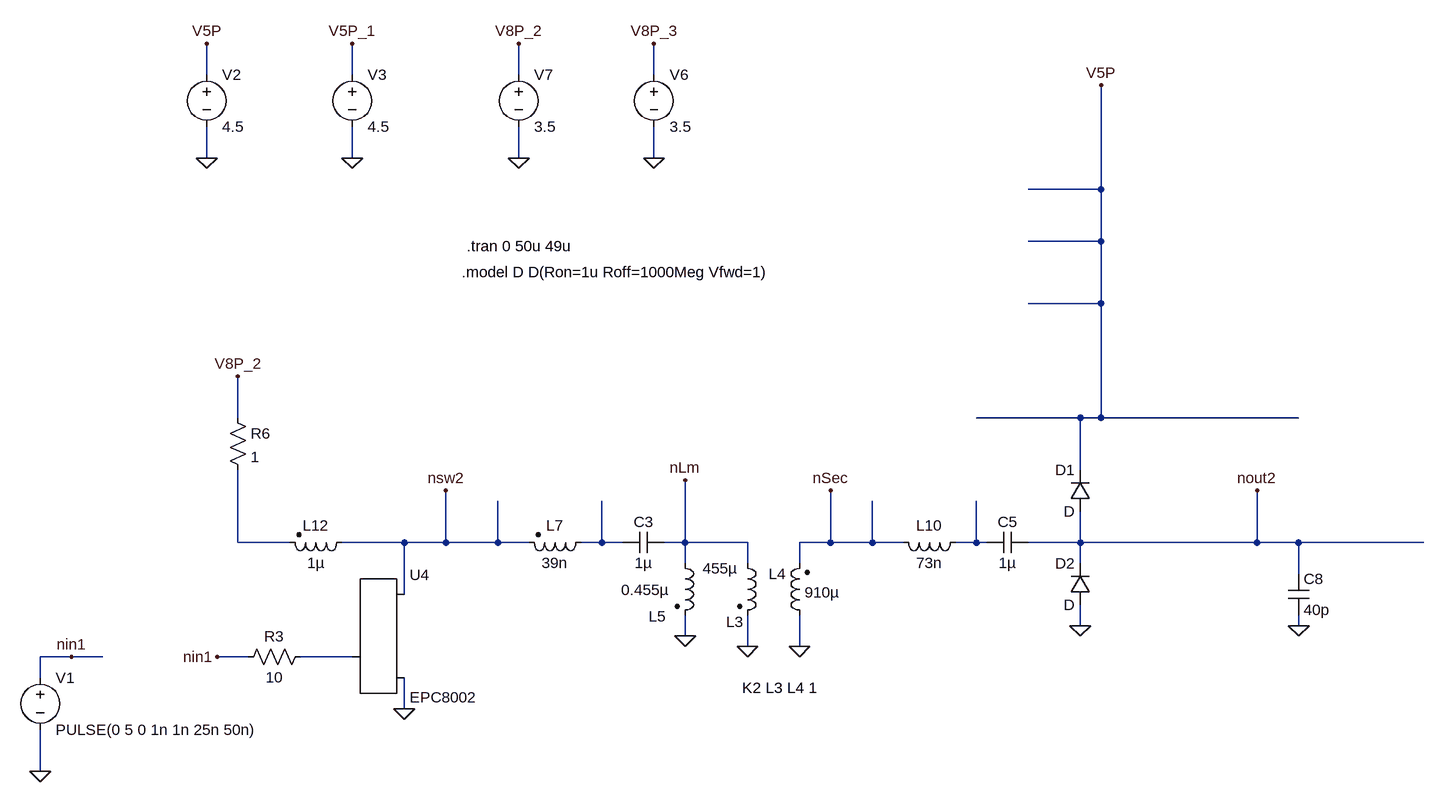
[diagram p0: schematic Ultrafast GD - 02162024.asc]
Ultrafast GD - 02162024.asc, the LTspice schematic file:
Version 4
SHEET 1 2564 2228
WIRE -528 0 -528 -48
WIRE -304 0 -304 -48
WIRE -48 0 -48 -48
WIRE 160 0 160 -48
WIRE -528 128 -528 80
WIRE -304 128 -304 80
WIRE -48 128 -48 80
WIRE 160 128 160 80
WIRE 848 176 848 16
WIRE 848 176 736 176
WIRE 848 256 848 176
WIRE 848 256 736 256
WIRE 848 352 848 256
WIRE 848 352 736 352
WIRE -480 528 -480 464
WIRE 816 528 656 528
WIRE 848 528 848 352
WIRE 848 528 816 528
WIRE 1152 528 848 528
WIRE 816 608 816 528
WIRE -480 720 -480 608
WIRE -400 720 -480 720
WIRE -224 720 -320 720
WIRE -160 720 -160 640
WIRE -160 720 -224 720
WIRE -80 720 -80 656
WIRE -80 720 -160 720
WIRE -32 720 -80 720
WIRE 80 720 80 656
WIRE 80 720 48 720
WIRE 112 720 80 720
WIRE 208 720 208 624
WIRE 208 720 176 720
WIRE 304 720 208 720
WIRE 432 720 432 640
WIRE 432 720 384 720
WIRE 496 720 496 656
WIRE 496 720 432 720
WIRE 544 720 496 720
WIRE 656 720 656 656
WIRE 656 720 624 720
WIRE 672 720 656 720
WIRE 816 720 816 672
WIRE 816 720 736 720
WIRE 1088 720 1088 640
WIRE 1088 720 816 720
WIRE 1152 720 1088 720
WIRE 1344 720 1152 720
WIRE 208 752 208 720
WIRE 304 752 304 720
WIRE 384 752 384 720
WIRE 816 752 816 720
WIRE 1152 768 1152 720
WIRE -224 800 -224 720
WIRE 816 848 816 816
WIRE 1152 848 1152 832
WIRE 208 864 208 832
WIRE 304 880 304 832
WIRE 384 880 384 832
WIRE -736 896 -784 896
WIRE -688 896 -736 896
WIRE -464 896 -512 896
WIRE -304 896 -384 896
WIRE -784 928 -784 896
WIRE -224 976 -224 928
WIRE -784 1072 -784 1008
FLAG -528 128 0
FLAG -528 -48 V5P
FLAG -784 1072 0
FLAG -736 896 nin1
FLAG 304 880 0
FLAG 384 880 0
FLAG 816 848 0
FLAG -224 976 0
FLAG -480 464 V8P_2
FLAG 1088 640 nout2
FLAG -160 640 nsw2
FLAG -48 128 0
FLAG -48 -48 V8P_2
FLAG -512 896 nin1
FLAG 1152 848 0
FLAG 848 16 V5P
FLAG 208 864 0
FLAG 208 624 nLm
FLAG 432 640 nSec
FLAG 160 128 0
FLAG 160 -48 V8P_3
FLAG -304 128 0
FLAG -304 -48 V5P_1
SYMBOL voltage -784 912 R0
WINDOW 123 0 0 Left 0
WINDOW 39 0 0 Left 0
SYMATTR InstName V1
SYMATTR Value PULSE(0 5 0 1n 1n 25n 50n)
SYMBOL voltage -528 -16 R0
WINDOW 123 0 0 Left 0
WINDOW 39 0 0 Left 0
SYMATTR InstName V2
SYMATTR Value 4.5
SYMBOL ind2 288 736 R0
WINDOW 0 -17 106 Left 2
WINDOW 3 -53 24 Left 2
SYMATTR InstName L3
SYMATTR Value 455µ
SYMATTR Type ind
SYMBOL ind2 400 848 R180
WINDOW 0 36 80 Left 2
WINDOW 3 -46 51 Left 2
SYMATTR InstName L4
SYMATTR Value 910µ
SYMATTR Type ind
SYMBOL cap 176 704 R90
WINDOW 0 0 32 VBottom 2
WINDOW 3 32 32 VTop 2
SYMATTR InstName C3
SYMATTR Value 1µ
SYMBOL cap 736 704 R90
WINDOW 0 0 32 VBottom 2
WINDOW 3 32 32 VTop 2
SYMATTR InstName C5
SYMATTR Value 1µ
SYMBOL EPCGaN -304 896 R0
SYMATTR InstName U4
SYMATTR Value EPC8002
SYMBOL res -368 880 R90
WINDOW 0 0 56 VBottom 2
WINDOW 3 32 56 VTop 2
SYMATTR InstName R3
SYMATTR Value 10
SYMBOL ind2 64 704 R90
WINDOW 0 5 56 VBottom 2
WINDOW 3 32 56 VTop 2
SYMATTR InstName L7
SYMATTR Value 39n
SYMATTR SpiceLine Rser=0.85
SYMATTR Type ind
SYMBOL ind 640 704 R90
WINDOW 0 5 56 VBottom 2
WINDOW 3 32 56 VTop 2
SYMATTR InstName L10
SYMATTR Value 73n
SYMATTR SpiceLine Rser=1.7
SYMBOL ind2 -304 704 R90
WINDOW 0 5 56 VBottom 2
WINDOW 3 32 56 VTop 2
SYMATTR InstName L12
SYMATTR Value 1µ
SYMATTR Type ind
SYMBOL voltage -48 -16 R0
WINDOW 123 0 0 Left 0
WINDOW 39 0 0 Left 0
SYMATTR InstName V7
SYMATTR Value 3.5
SYMBOL res -496 512 R0
SYMATTR InstName R6
SYMATTR Value 1
SYMBOL diode 832 672 R180
WINDOW 0 24 64 Left 2
WINDOW 3 24 0 Left 2
SYMATTR InstName D1
SYMBOL diode 832 816 R180
WINDOW 0 24 64 Left 2
WINDOW 3 24 0 Left 2
SYMATTR InstName D2
SYMBOL cap 1136 768 R0
SYMATTR InstName C8
SYMATTR Value 40p
SYMBOL ind2 192 736 R0
WINDOW 0 -40 98 Left 2
WINDOW 3 -82 57 Left 2
SYMATTR InstName L5
SYMATTR Value 0.455µ
SYMATTR Type ind
SYMBOL voltage 160 -16 R0
WINDOW 123 0 0 Left 0
WINDOW 39 0 0 Left 0
SYMATTR InstName V6
SYMATTR Value 3.5
SYMBOL voltage -304 -16 R0
WINDOW 123 0 0 Left 0
WINDOW 39 0 0 Left 0
SYMATTR InstName V3
SYMATTR Value 4.5
TEXT -128 264 Left 2 !.tran 0 50u 49u
TEXT -136 304 Left 2 !.model D D(Ron=1u Roff=1000Meg Vfwd=1)
TEXT 296 944 Left 2 !K2 L3 L4 1

The netlist it stands for:
* Ultrafast GD - 02162024.asc
V1 nin1 0 PULSE(0 5 0 1n 1n 25n 50n)
V2 V5P 0 4.5
L3 nLm 0 455µ
L4 0 nSec 910µ
C3 nLm N002 1µ
C5 nout2 N003 1µ
XU4 N004 nsw2 0 EPC8002
R3 N004 nin1 10
L7 N002 nsw2 39n Rser=0.85
L10 N003 nSec 73n Rser=1.7
L12 nsw2 N001 1µ
V7 V8P_2 0 3.5
R6 V8P_2 N001 1
D1 nout2 V5P D
D2 0 nout2 D
C8 nout2 0 40p
L5 nLm 0 0.455µ
V6 V8P_3 0 3.5
V3 V5P_1 0 4.5
.model D D
.lib standard.dio
.tran 0 50u 49u
.model D D(Ron=1u Roff=1000Meg Vfwd=1)
K2 L3 L4 1
.backanno
.end